# EasyEDA schematic Sheet_1.json
TITLE: Sheet_1; REV: 1.0; Date: 2022-10-20; Sheet: 1/1; Drawn By: samtao.coulet; Company: Your Company
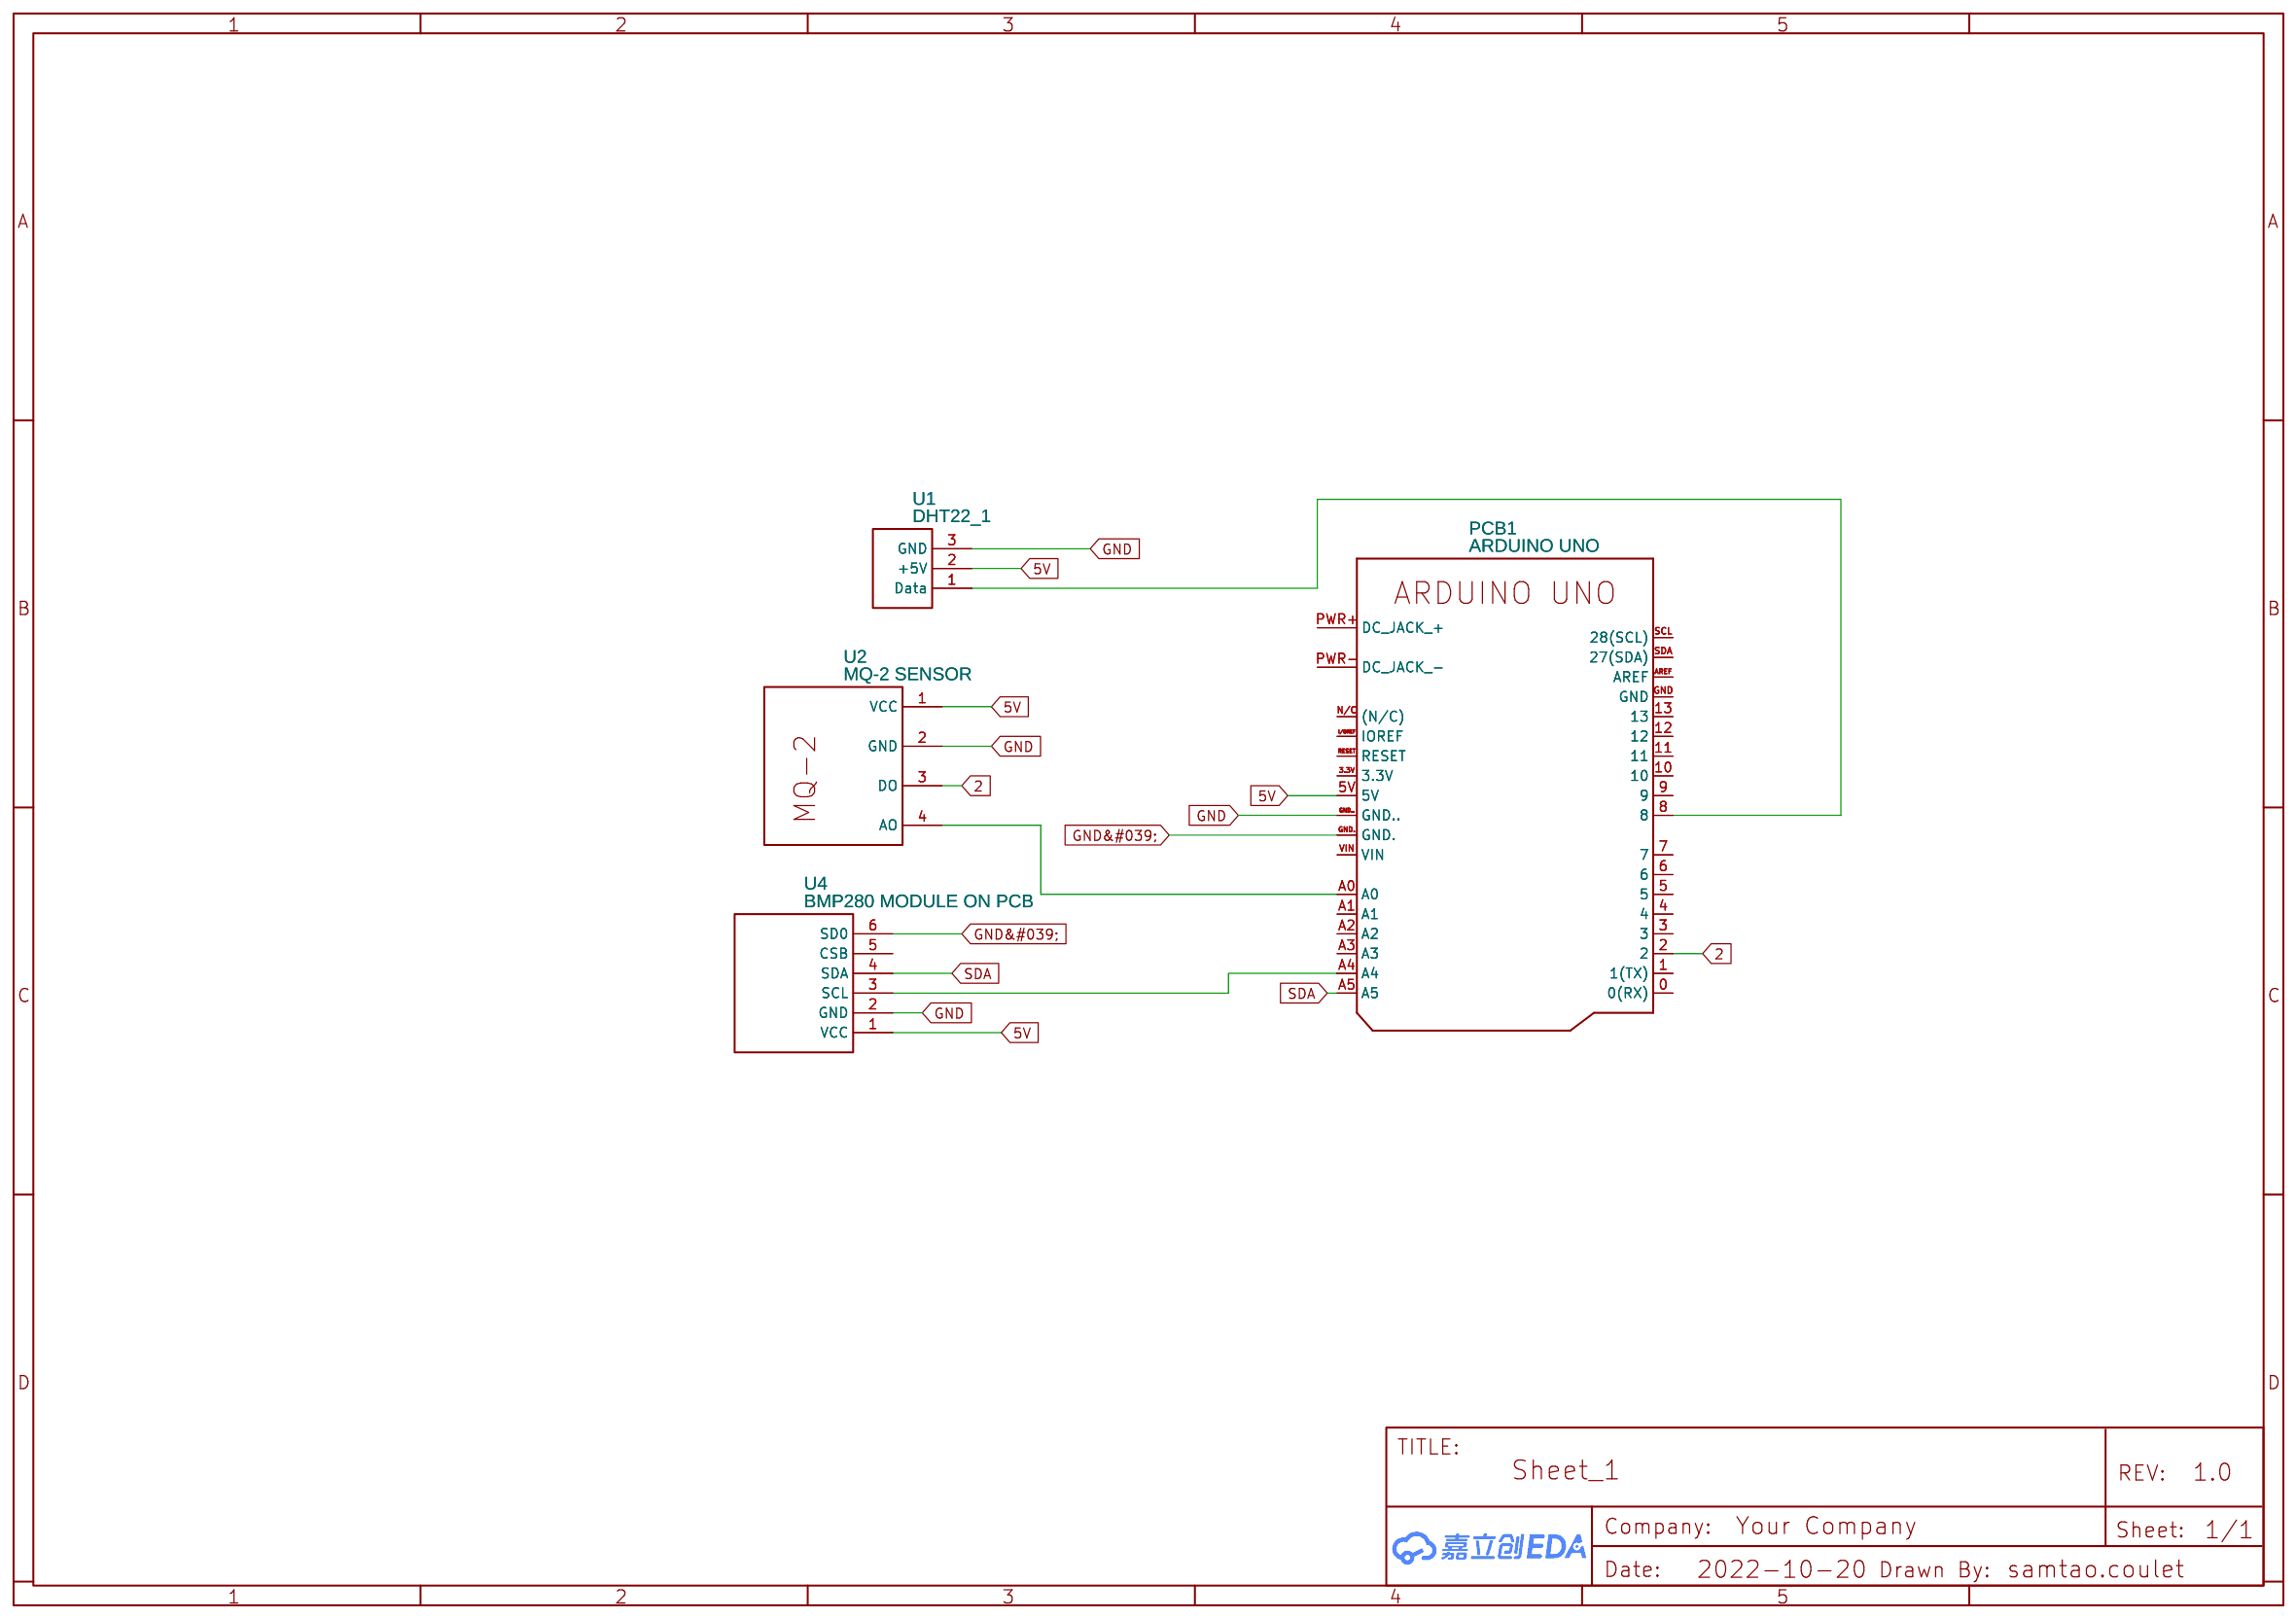
[diagram p0: schematic sheet]

## Parts
PCB1  ARDUINO UNO  [E14_ARDUINO_PUBLISHED_ARDUINO_UNO]
U1  DHT22_1  [DHT22_1]
U2  MQ-2 SENSOR  [MQ-2]
U4  BMP280 MODULE ON PCB  [6 PIN 600X500 MIL BMP/BME 280]

## Library data of the parts
PCB1 = ARDUINO UNO: Contributor: adityaaryan.singh.etc; Supplier: Botland
U1 = DHT22_1: Contributor: kleine_eiche
U2 = MQ-2 SENSOR: Supplier Part: undefined; Contributor: nikolay.mediana
U4 = BMP280 MODULE ON PCB: Manufacturer Part: BMP280 Module; Supplier Part: BMP280; Supplier: eBay; Contributor: jf78727; subpart_no: 2

## Nets
5V: PCB1.5V U1.2(+5V) U2.1(VCC) U4.1(VCC)
GND: PCB1.GND.. U1.3(GND) U2.2(GND) U4.2(GND)
GND&#039;: PCB1.GND. U4.6(SD0)
2: PCB1.2 U2.3(DO)
SDA: PCB1.A5 U4.4(SDA)
Net-(PCB1-8): PCB1.8 U1.1(Data)
Net-(PCB1-A0): PCB1.A0 U2.4(AO)
Net-(PCB1-A4): PCB1.A4 U4.3(SCL)

Not connected (* = marked no-connect by the designer): PCB1 0(0(RX)) 1(1(TX)) 3 3.3V 4 5 6 7 9 10 11 12 13 A1 A2 A3 AREF GND I/OREF(IOREF) N/C((N/C)) PWR+(DC JACK +) PWR-(DC JACK -) RESET SCL(28(SCL)) SDA(27(SDA)) VIN; U4 5(CSB)
